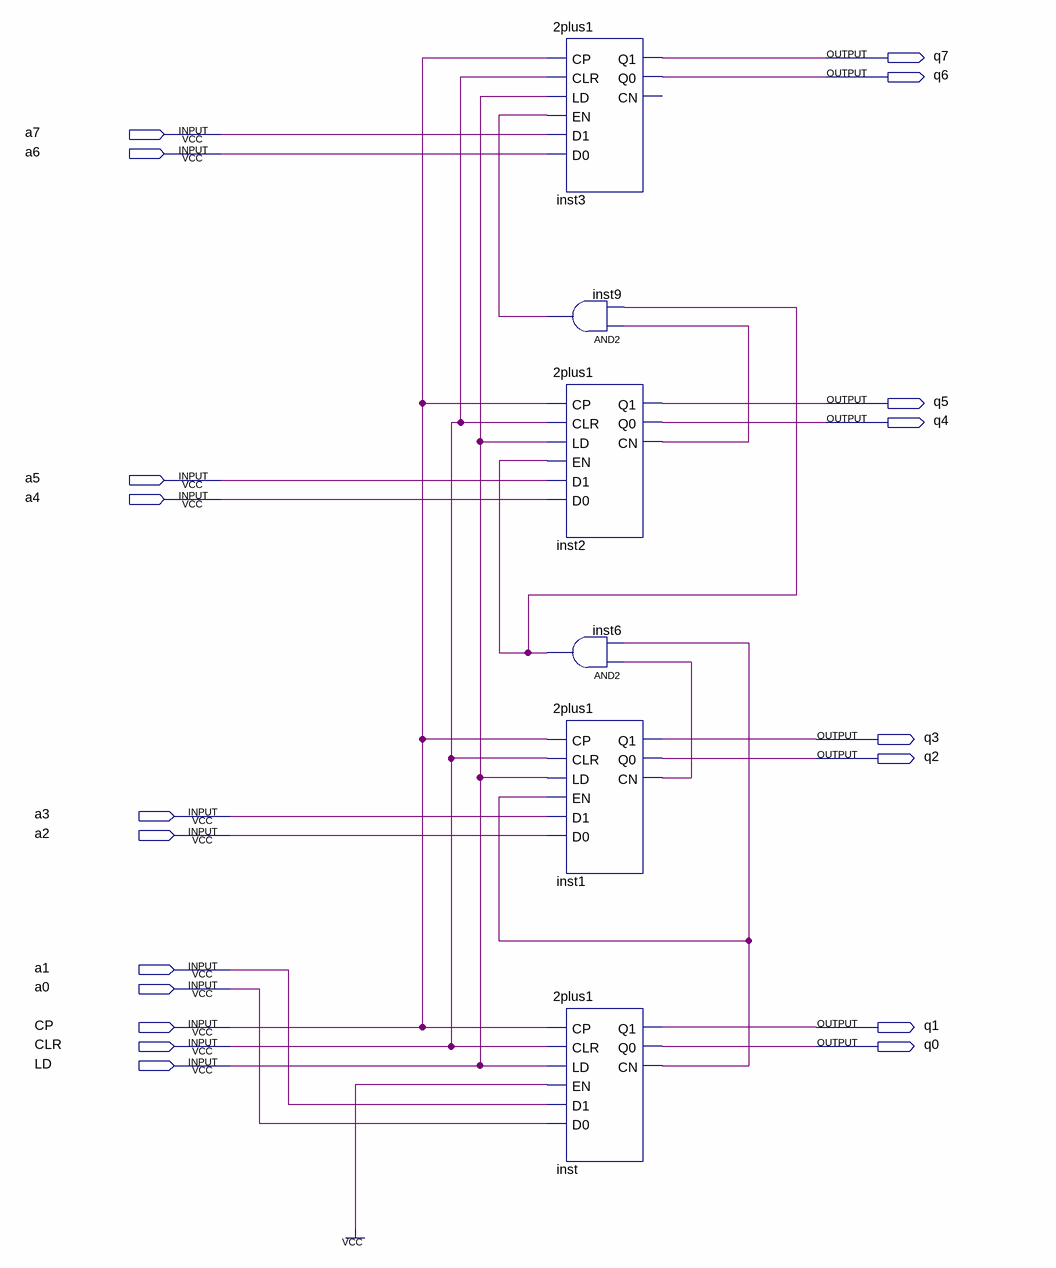
[diagram p0: schematic sheet]
// Quartus schematic 256Plus1.bdf as structural Verilog: 6 symbols, 19 pins
module \256Plus1  (
  input  a7,
  input  a6,
  input  a5,
  input  a4,
  input  a3,
  input  a2,
  input  a1,
  input  a0,
  input  CP,
  input  CLR,
  input  LD,
  output q7,
  output q6,
  output q5,
  output q4,
  output q3,
  output q2,
  output q1,
  output q0
);

  wire inst1_cn, inst2_cn, inst6_out, inst9_out, inst_cn;

  \2plus1  inst3 (.CP(CP), .CLR(CLR), .LD(LD), .EN(inst9_out), .D1(a7), .D0(a6), .Q1(q7), .Q0(q6));  // open: CN
  and inst9 (inst9_out, inst2_cn, inst6_out);
  \2plus1  inst2 (.CP(CP), .CLR(CLR), .LD(LD), .EN(inst6_out), .D1(a5), .D0(a4), .Q1(q5), .Q0(q4), .CN(inst2_cn));
  and inst6 (inst6_out, inst1_cn, inst_cn);
  \2plus1  inst1 (.CP(CP), .CLR(CLR), .LD(LD), .EN(inst_cn), .D1(a3), .D0(a2), .Q1(q3), .Q0(q2), .CN(inst1_cn));
  \2plus1  inst (.CP(CP), .CLR(CLR), .LD(LD), .EN(1'b1), .D1(a1), .D0(a0), .Q1(q1), .Q0(q0), .CN(inst_cn));
endmodule
